# Altium schematic sheet block-sheme.SchDoc
size A
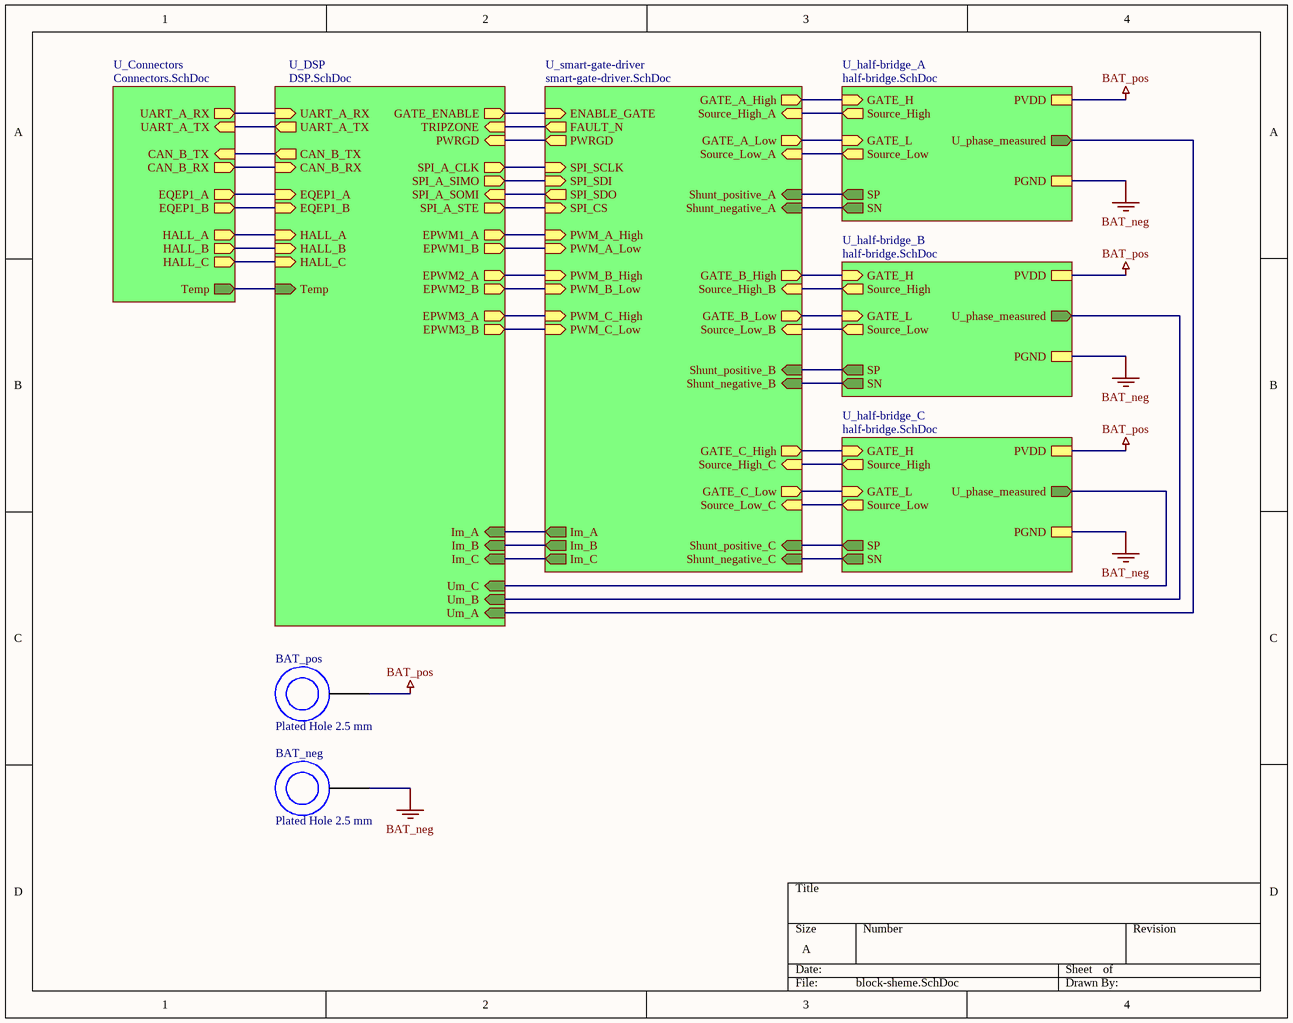
[diagram p0: block-sheme.SchDoc]

## Parts
BAT_neg  Plated Hole 2.5 mm  [Plated Hole 2.5mm]
BAT_pos  Plated Hole 2.5 mm  [Plated Hole 2.5mm]

## Sub-sheets
U_Connectors = Connectors.SchDoc: UART_A_RX (out), UART_A_TX (in), EQEP1_A (out), EQEP1_B (out), CAN_B_RX (out), CAN_B_TX (in), HALL_A (out), HALL_B (out), HALL_C (out), Temp (out)
U_DSP = DSP.SchDoc: UART_A_RX (in), UART_A_TX (out), CAN_B_RX (in), CAN_B_TX (out), EPWM1_A (out), EPWM1_B (out), EPWM2_A (out), EPWM2_B (out), EPWM3_A (out), EPWM3_B (out), SPI_A_CLK (out), SPI_A_SIMO (out), SPI_A_SOMI (in), SPI_A_STE (out), EQEP1_A (in), EQEP1_B (in), TRIPZONE (in), GATE_ENABLE (out), Im_A (in), Im_B (in), Im_C (in), Um_A (in), Um_B (in), Um_C (in), PWRGD (in), HALL_A (in), HALL_B (in), HALL_C (in), Temp (in)
U_half-bridge_A = half-bridge.SchDoc: GATE_H (in), GATE_L (in), SP (out), SN (out), Source_High (out), Source_Low (out), PGND, PVDD, U_phase_measured (out)
U_half-bridge_B = half-bridge.SchDoc: GATE_H (in), GATE_L (in), SP (out), SN (out), Source_High (out), Source_Low (out), PGND, PVDD, U_phase_measured (out)
U_half-bridge_C = half-bridge.SchDoc: GATE_H (in), GATE_L (in), SP (out), SN (out), Source_High (out), Source_Low (out), PVDD, PGND, U_phase_measured (out)
U_smart-gate-driver = smart-gate-driver.SchDoc: GATE_A_High (out), GATE_A_Low (out), GATE_B_High (out), GATE_B_Low (out), GATE_C_High (out), GATE_C_Low (out), Shunt_negative_A (in), Shunt_positive_A (in), Shunt_negative_B (in), Shunt_positive_B (in), Shunt_negative_C (in), Shunt_positive_C (in), PWM_C_High (in), PWM_B_Low (in), PWM_A_Low (in), PWM_B_High (in), PWM_C_Low (in), PWM_A_High (in), SPI_SDI (in), SPI_SDO (out), ENABLE_GATE (in), SPI_SCLK (in), SPI_CS (in), FAULT_N (out), PWRGD (out), Source_High_A (in), Source_High_B (in), Source_High_C (in), Source_Low_A (in), Source_Low_B (in), Source_Low_C (in), Im_A (out), Im_B (out), Im_C (out)

## Nets
BAT_neg: BAT_neg.1 ; sheet U_half-bridge_A/PGND, sheet U_half-bridge_B/PGND, sheet U_half-bridge_C/PGND
BAT_pos: BAT_pos.1 ; sheet U_half-bridge_A/PVDD, sheet U_half-bridge_B/PVDD, sheet U_half-bridge_C/PVDD
(unnamed): sheet U_half-bridge_A/GATE_H, sheet U_smart-gate-driver/GATE_A_High
(unnamed): sheet U_half-bridge_A/GATE_L, sheet U_smart-gate-driver/GATE_A_Low
(unnamed): sheet U_half-bridge_A/SP, sheet U_smart-gate-driver/Shunt_positive_A
(unnamed): sheet U_half-bridge_A/SN, sheet U_smart-gate-driver/Shunt_negative_A
(unnamed): sheet U_half-bridge_A/Source_High, sheet U_smart-gate-driver/Source_High_A
(unnamed): sheet U_half-bridge_A/Source_Low, sheet U_smart-gate-driver/Source_Low_A
(unnamed): sheet U_half-bridge_A/U_phase_measured, sheet U_DSP/Um_A
(unnamed): sheet U_smart-gate-driver/GATE_B_High, sheet U_half-bridge_B/GATE_H
(unnamed): sheet U_smart-gate-driver/GATE_B_Low, sheet U_half-bridge_B/GATE_L
(unnamed): sheet U_smart-gate-driver/GATE_C_High, sheet U_half-bridge_C/GATE_H
(unnamed): sheet U_smart-gate-driver/GATE_C_Low, sheet U_half-bridge_C/GATE_L
(unnamed): sheet U_smart-gate-driver/Shunt_negative_B, sheet U_half-bridge_B/SN
(unnamed): sheet U_smart-gate-driver/Shunt_positive_B, sheet U_half-bridge_B/SP
(unnamed): sheet U_smart-gate-driver/Shunt_negative_C, sheet U_half-bridge_C/SN
(unnamed): sheet U_smart-gate-driver/Shunt_positive_C, sheet U_half-bridge_C/SP
(unnamed): sheet U_smart-gate-driver/PWM_C_High, sheet U_DSP/EPWM3_A
(unnamed): sheet U_smart-gate-driver/PWM_B_Low, sheet U_DSP/EPWM2_B
(unnamed): sheet U_smart-gate-driver/PWM_A_Low, sheet U_DSP/EPWM1_B
(unnamed): sheet U_smart-gate-driver/PWM_B_High, sheet U_DSP/EPWM2_A
(unnamed): sheet U_smart-gate-driver/PWM_C_Low, sheet U_DSP/EPWM3_B
(unnamed): sheet U_smart-gate-driver/PWM_A_High, sheet U_DSP/EPWM1_A
(unnamed): sheet U_smart-gate-driver/SPI_SDI, sheet U_DSP/SPI_A_SIMO
(unnamed): sheet U_smart-gate-driver/SPI_SDO, sheet U_DSP/SPI_A_SOMI
(unnamed): sheet U_smart-gate-driver/ENABLE_GATE, sheet U_DSP/GATE_ENABLE
(unnamed): sheet U_smart-gate-driver/SPI_SCLK, sheet U_DSP/SPI_A_CLK
(unnamed): sheet U_smart-gate-driver/SPI_CS, sheet U_DSP/SPI_A_STE
(unnamed): sheet U_smart-gate-driver/FAULT_N, sheet U_DSP/TRIPZONE
(unnamed): sheet U_smart-gate-driver/PWRGD, sheet U_DSP/PWRGD
(unnamed): sheet U_smart-gate-driver/Source_High_B, sheet U_half-bridge_B/Source_High
(unnamed): sheet U_smart-gate-driver/Source_High_C, sheet U_half-bridge_C/Source_High
(unnamed): sheet U_smart-gate-driver/Source_Low_B, sheet U_half-bridge_B/Source_Low
(unnamed): sheet U_smart-gate-driver/Source_Low_C, sheet U_half-bridge_C/Source_Low
(unnamed): sheet U_smart-gate-driver/Im_A, sheet U_DSP/Im_A
(unnamed): sheet U_smart-gate-driver/Im_B, sheet U_DSP/Im_B
(unnamed): sheet U_smart-gate-driver/Im_C, sheet U_DSP/Im_C
(unnamed): sheet U_half-bridge_B/U_phase_measured, sheet U_DSP/Um_B
(unnamed): sheet U_half-bridge_C/U_phase_measured, sheet U_DSP/Um_C
(unnamed): sheet U_DSP/UART_A_RX, sheet U_Connectors/UART_A_RX
(unnamed): sheet U_DSP/UART_A_TX, sheet U_Connectors/UART_A_TX
(unnamed): sheet U_DSP/CAN_B_RX, sheet U_Connectors/CAN_B_RX
(unnamed): sheet U_DSP/CAN_B_TX, sheet U_Connectors/CAN_B_TX
(unnamed): sheet U_DSP/EQEP1_A, sheet U_Connectors/EQEP1_A
(unnamed): sheet U_DSP/EQEP1_B, sheet U_Connectors/EQEP1_B
(unnamed): sheet U_DSP/HALL_A, sheet U_Connectors/HALL_A
(unnamed): sheet U_DSP/HALL_B, sheet U_Connectors/HALL_B
(unnamed): sheet U_DSP/HALL_C, sheet U_Connectors/HALL_C
(unnamed): sheet U_DSP/Temp, sheet U_Connectors/Temp